# Altium schematic sheet core-unit.SchDoc
size 420 x 297 mm; SheetNumber: 1; SheetTotal: 2
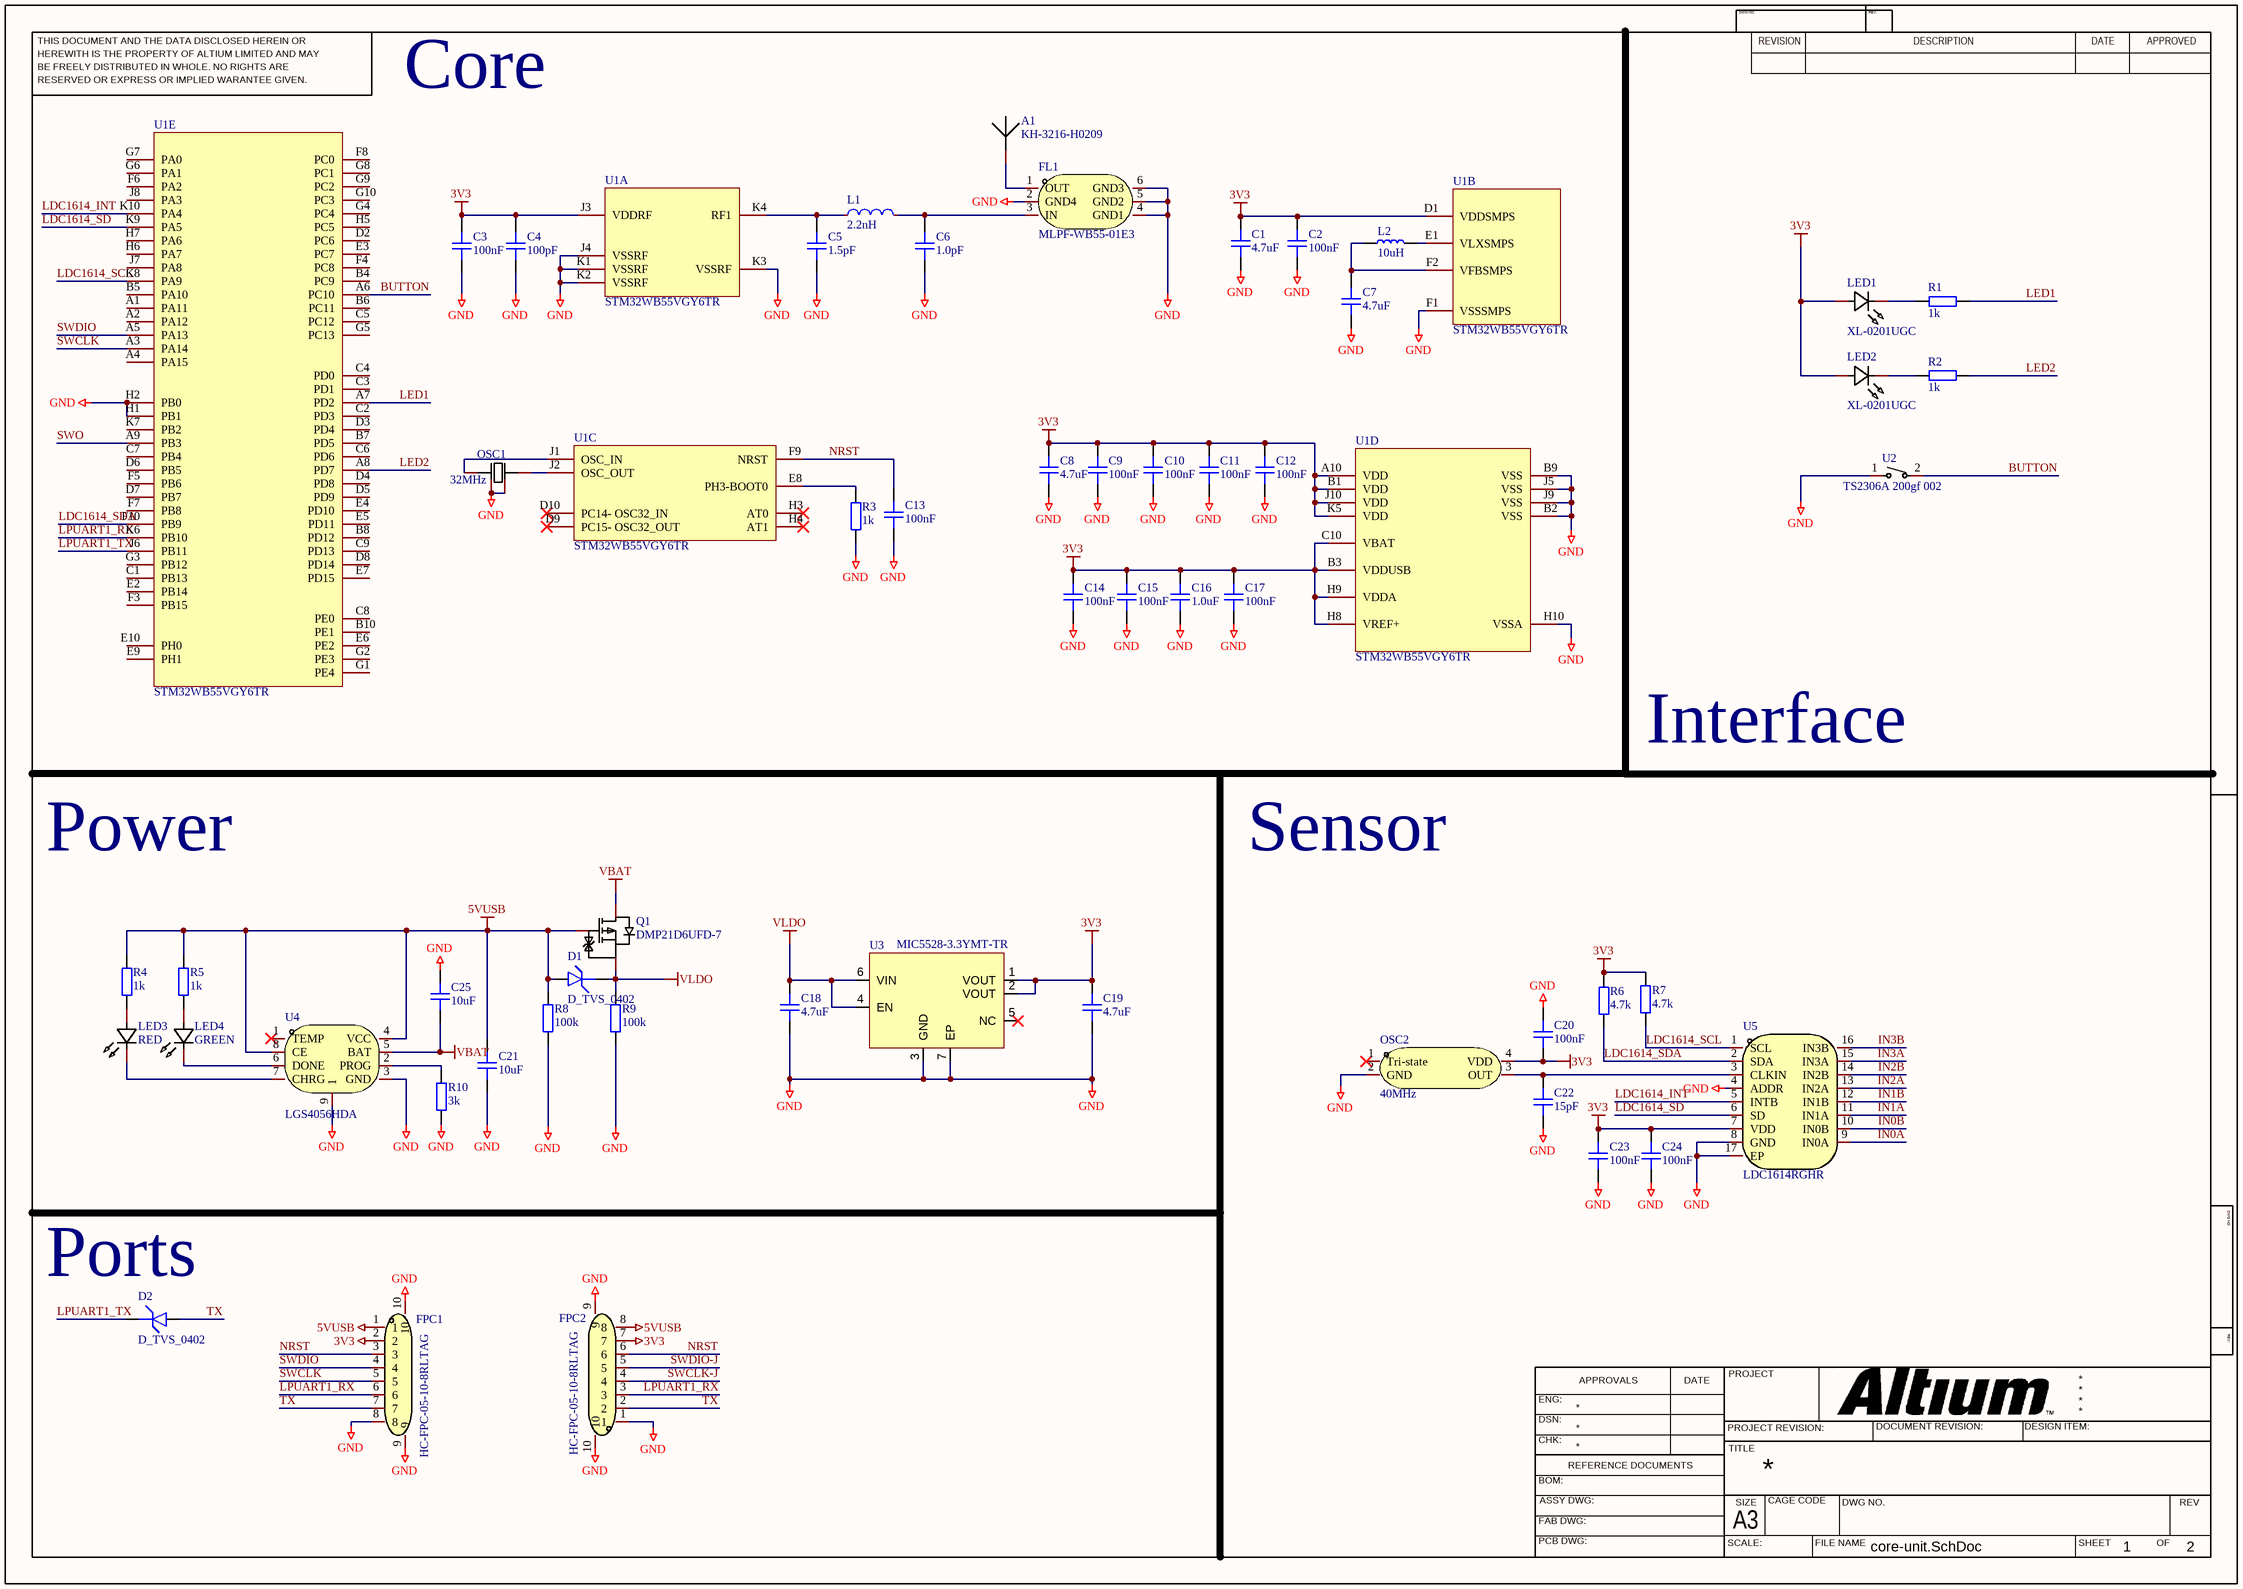
[diagram p0: core-unit.SchDoc]

## Parts
A1  KH-3216-H0209  [ANT-SMD_L1.7-W0.9]
C1  4.7uF  [CAP_0201]
C2  100nF  [CAP_0201]
C3  100nF  [CAP_0201]
C4  100pF  [CAP_0201]
C5  1.5pF  [CAP_0201]
C6  1.0pF  [CAP_0201]
C7  4.7uF  [CAP_0201]
C8  4.7uF  [CAP_0201]
C9  100nF  [CAP_0201]
C10  100nF  [CAP_0201]
C11  100nF  [CAP_0201]
C12  100nF  [CAP_0201]
C13  100nF  [CAP_0201]
C14  100nF  [CAP_0201]
C15  100nF  [CAP_0201]
C16  1.0uF  [CAP_0201]
C17  100nF  [CAP_0201]
C18  4.7uF  [CAP_0201]
C19  4.7uF  [CAP_0201]
C20  100nF  [CAP_0201]
C21  10uF  [CAP_0603]
C22  15pF  [CAP_0201]
C23  100nF  [CAP_0201]
C24  100nF  [CAP_0201]
C25  10uF  [CAP_0603]
D1  D_TVS_0402  [D_0402]
D2  D_TVS_0402  [D_0402]
FL1  MLPF-WB55-01E3  [FILTER-SMD_6P-L1.6-W1.0-P0.50-BL]
FPC1  HC-FPC-05-10-8RLTAG  [FPC-SMD_8P-P0.50_HCTL_HC-FPC-05-10-8RLTAG]
FPC2  HC-FPC-05-10-8RLTAG  [FPC-SMD_8P-P0.50_HCTL_HC-FPC-05-10-8RLTAG]
L1  2.2nH  [L0201]
L2  10uH  [IND_0603]
LED1  XL-0201UGC  [LED-SMD_L0.7-W0.4-RD_GREEN]
LED2  XL-0201UGC  [LED-SMD_L0.7-W0.4-RD_GREEN]
LED3  Name: RED  [LED-SMD_L0.7-W0.4-RD_GREEN]  (hidden comment: XL-0201UGC)
LED4  Name: GREEN  [LED-SMD_L0.7-W0.4-RD_GREEN]  (hidden comment: XL-0201UGC)
OSC1  32MHz  [CRYSTAL-SMD_4P-L1.6-W1.2-BL-1]
OSC2  40MHz  [OSC-SMD_4P-L2.0-W1.6-BL]
Q1  DMP21D6UFD-7  [X1-DFN1212-3_L1.2-W1.2-P0.80-BR]
R1  1k  [RES_0201]
R2  1k  [RES_0201]
R3  1k  [RES_0201]
R4  1k  [RES_0201]
R5  1k  [RES_0201]
R6  4.7k  [RES_0201]
R7  4.7k  [RES_0201]
R8  100k  [RES_0201]
R9  100k  [RES_0201]
R10  3k  [RES_0201]
U1  STM32WB55VGY6TR  [WLCSP-100_L4.4-W4.4-R10-C10-P0.40-TL_STM32WB55VGY6TR]  (parts A,B,C,D,E of 5)
U2  TS2306A 200gf 002  [SW-SMD_L3.0-W2.0-LS3.5]
U3  MIC5528-3.3YMT-TR  [TDFN-6]
U4  LGS4056HDA  [DFN-8_L2.0-W2.0-P0.50-TL-EP1.6]
U5  LDC1614RGHR  [WQFN-16_L4.0-W4.0-P0.50-TL-EP2.6-1]

## Nets
3V3: C1.2 C2.2 C3.2 C4.2 C8.2 C9.2 C10.2 C11.2 C12.2 C14.2 C15.2 C16.2 C17.2 C19.2 C20.1 C23.2 C24.2 FPC1.2 FPC2.7 LED1.2(A) LED2.2(A) OSC2.4(VDD) R6.2 R7.2 U1.A10(VDD) U1.B1(VDD) U1.B3(VDDUSB) U1.C10(VBAT) U1.D1(VDDSMPS) U1.H8(VREF+) U1.H9(VDDA) U1.J3(VDDRF) U1.J10(VDD) U1.K5(VDD) U3.1(VOUT) U3.2(VOUT) U5.7(VDD)
5VUSB: C21.2 D1.A FPC1.1 FPC2.8 Q1.1(G) R4.2 R5.2 R8.2 U4.4(VCC) U4.8(CE)
GND: C1.1 C2.1 C3.1 C4.1 C5.1 C6.1 C7.1 C8.1 C9.1 C10.1 C11.1 C12.1 C13.1 C14.1 C15.1 C16.1 C17.1 C18.1 C19.1 C20.2 C21.1 C22.1 C23.1 C24.1 C25.1 FL1.2(GND4) FL1.4(GND1) FL1.5(GND2) FL1.6(GND3) FPC1.8 FPC1.9 FPC1.10 FPC2.1 FPC2.9 FPC2.10 OSC1.2(GND) OSC1.4(GND) OSC2.2(GND) R3.1 R8.1 R9.1 R10.1 U1.B2(VSS) U1.B9(VSS) U1.F1(VSSSMPS) U1.H1(PB1) U1.H2(PB0) U1.H10(VSSA) U1.J4(VSSRF) U1.J5(VSS) U1.J9(VSS) U1.K1(VSSRF) U1.K2(VSSRF) U1.K3(VSSRF) U2.1(A) U3.3(GND) U3.7(EP) U4.3(GND) U4.9(1) U5.4(ADDR) U5.8(GND) U5.17(EP)
VBAT: C25.2 Q1.3(D) U4.5(BAT)
VLDO: C18.2 D1.K Q1.2(S) R9.2 U3.4(EN) U3.6(VIN)
BUTTON: U1.A6(PC10) U2.2(A&apos;)
IN0A: U5.9(IN0A)
IN0B: U5.10(IN0B)
IN1A: U5.11(IN1A)
IN1B: U5.12(IN1B)
IN2A: U5.13(IN2A)
IN2B: U5.14(IN2B)
IN3A: U5.15(IN3A)
IN3B: U5.16(IN3B)
LDC1614_INT: U1.K10(PA4) U5.5(INTB)
LDC1614_SCL: R7.1 U1.K8(PA9) U5.1(SCL)
LDC1614_SD: U1.K9(PA5) U5.6(SD)
LDC1614_SDA: R6.1 U1.F10(PB9) U5.2(SDA)
LED1: R1.1 U1.A7(PD2)
LED2: R2.1 U1.A8(PD7)
LPUART1_RX: FPC1.6 FPC2.3 U1.K6(PB10)
LPUART1_TX: D2.K U1.J6(PB11)
NRST: C13.2 FPC1.3 FPC2.6 U1.F9(NRST)
SWCLK: FPC1.5 U1.A3(PA14)
SWCLK-J: FPC2.4
SWDIO: FPC1.4 U1.A5(PA13)
SWDIO-J: FPC2.5
SWO: U1.A9(PB3)
TX: D2.A FPC1.7 FPC2.2
NetA1_1: A1.1(ANT) FL1.1(OUT)
NetC5_2: C5.2 L1.1 U1.K4(RF1)
NetC6_2: C6.2 FL1.3(IN) L1.2
NetC7_2: C7.2 L2.1 U1.F2(VFBSMPS)
NetC22_2: C22.2 OSC2.3(OUT) U5.3(CLKIN)
NetL2_2: L2.2 U1.E1(VLXSMPS)
NetLED1_1: LED1.1(K) R1.2
NetLED2_1: LED2.1(K) R2.2
NetLED3_1: LED3.1(K) U4.7(CHRG)
NetLED3_2: LED3.2(A) R4.1
NetLED4_1: LED4.1(K) U4.6(DONE)
NetLED4_2: LED4.2(A) R5.1
NetOSC1_1: OSC1.1(OSC1) U1.J2(OSC_OUT)
NetOSC1_3: OSC1.3(OSC2) U1.J1(OSC_IN)
NetR3_2: R3.2 U1.E8(PH3-BOOT0)
NetR10_2: R10.2 U4.2(PROG)

Not connected (* = marked no-connect by the designer): A1 2; OSC2 1(Tri-state)*; U1 A1(PA11) A2(PA12) A4(PA15) B4(PC9) B5(PA10) B6(PC11) B7(PD5) B8(PD12) B10(PE1) C1(PB13) C2(PD3) C3(PD1) C4(PD0) C5(PC12) C6(PD6) C7(PB4) C8(PE0) C9(PD13) D2(PC6) D3(PD4) D4(PD8) D5(PD9) D6(PB5) D7(PB7) D8(PD14) D9(PC15-_OSC32_OUT)* D10(PC14-_OSC32_IN)* E2(PB14) E3(PC7) E4(PD10) E5(PD11) E6(PE2) E7(PD15) E9(PH1) E10(PH0) F3(PB15) F4(PC8) F5(PB6) F6(PA2) F7(PB8) F8(PC0) G1(PE4) G2(PE3) G3(PB12) G4(PC4) G5(PC13) G6(PA1) G7(PA0) G8(PC1) G9(PC2) G10(PC3) H3(AT0)* H4(AT1)* H5(PC5) H6(PA7) H7(PA6) J7(PA8) J8(PA3) K7(PB2); U3 5(NC)*; U4 1(TEMP)*

## Notes on the sheet
- Core
- Interface
- Power
- Sensor
- (near D2) Ports
- THIS DOCUMENT AND THE DATA DISCLOSED HEREIN OR
- HEREWITH IS THE PROPERTY OF ALTIUM LIMITED AND MAY
- DWG NO:
- REVISION
- REV:
- DESCRIPTION
- DATE
- APPROVED
- BE FREELY DISTRIBUTED IN WHOLE. NO RIGHTS ARE
- RESERVED OR EXPRESS OR IMPLIED WARANTEE GIVEN.
- ENG:
- APPROVALS
- PROJECT
- DSN:
- CHK:
- REFERENCE DOCUMENTS
- PROJECT REVISION:
- TITLE
- DOCUMENT REVISION:
- DESIGN ITEM:
- BOM:
- FAB DWG:
- PCB DWG:
- ASSY DWG:
- SCALE:
- A3
- SIZE
- CAGE CODE
- FILE NAME
- DWG NO.
- SHEET
- OF
- REV

## Library data of the parts
A1 = ANTENNA: 陶瓷贴片天线; Manufacturer: kinghelm(金航标); Add into BOM: yes; Symbol: KH-3216-H0209; Device: KH-3216-H0209; LCSC Part Name: KH-3216-H0209; Supplier Part: C2925417; Manufacturer Part: KH-3216-H0209; Supplier Footprint: 1206; JLCPCB Part Class: 扩展库; Datasheet: https://atta.szlcsc.com/upload/public/pdf/source/20211126/47D9D63D1A7578CBC67CF3AB2A53F46A.pdf; Supplier: LCSC; Convert to PCB: yes; Name: KH-3216-H0209
C1-C20 C22-C24 = CAP_0201: Capacitor SMD 0201; Manufacturer: *; Manufacturer Part Number: *; Distributor Link: *; LCSC: *; Rating: *; Dielectric: *
C21 C25 = CAP_0603: Capacitor SMD 0603; Manufacturer: *; Manufacturer Part Number: *; Distributor Link: *; LCSC: *; Rating: *; Dielectric: *
D1 D2 = D_TVS_0402: Diode TVS / ESD 0402
FL1 = MLPF-WB55-01E3: 滤波器 2.4G; Manufacturer: ST(意法半导体); Add into BOM: yes; Bandwidth: 100MHz; Filter Type: 低通; Insertion Loss: 1.1dB; Symbol: MLPF-WB55-01E3; Device: MLPF-WB55-01E3; LCSC Part Name: 2.45GHz 中心 低通; Supplier Part: C2651048; Manufacturer Part: MLPF-WB55-01E3; Supplier Footprint: SMD-6P,1.6x1mm; JLCPCB Part Class: 扩展库; Datasheet: https://atta.szlcsc.com/upload/public/pdf/source/20210702/9A61CA581AD9994A0E14452110FC9469.pdf; Supplier: LCSC; Convert to PCB: yes; Name: MLPF-WB55-01E3
FPC1 FPC2 = HC-FPC-05-10-8RLTAG: FPC连接器 0.5mm pitch 8p; Manufacturer: HCTL(华灿天禄); Add into BOM: yes; Locking Feature: 翻盖式; FFC, FCB Thickness: 0.3mm; Symbol: HC-FPC-05-10-8RLTAG; Device: HC-FPC-05-10-8RLTAG; LCSC Part Name: 翻盖式 下接 P数:8P 间距:0.5mm; Supplier Part: C5213730; Manufacturer Part: HC-FPC-05-10-8RLTAG; Supplier Footprint: SMD,P=0.5mm,卧贴; JLCPCB Part Class: 扩展库; Datasheet: https://atta.szlcsc.com/upload/public/pdf/source/20221027/B2DE489DA152049D1F105170189CFB4E.pdf; Supplier: LCSC; Convert to PCB: yes; Contact Type: 下接; Number of Contacts: 8P; Pitch: 0.5mm; Mounting Type: 卧贴; Height Above Board: 1mm; Contact Material: 铜合金; Operating Temperature Range: -55℃~+85℃; Name: HC-FPC-05-10-8RLTAG
L1 = L0201: Manufacturer: muRata(村田); Symbol: LQP03TN2N2B02D; Add into BOM: yes; Rated Current: 600mA; DC Resistance (DCR): 150mΩ; Q @ Freq: 14@500MHz; Frequency - Self Resonant: 11GHz; Device: LQP03TN2N2B02D; LCSC Part Name: 2.2nH; Supplier Part: C98041; Manufacturer Part: LQP03TN2N2B02D; Supplier Footprint: 0201; JLCPCB Part Class: 扩展库; Datasheet: https://atta.szlcsc.com/upload/public/pdf/source/20200107/C157592_7FF58F85BAEF0D918ADFA12AEC0AEBA8.pdf; Supplier: LCSC; Convert to PCB: yes; Value: 2.2nH; Tolerance: -; Saturation Current (Isat): -; Ratings: -; Name: 2.2nH
L2 = IND_0603: Inductor SMD 0603
LED1-LED4 = LED_0201: Manufacturer: XINGLIGHT(成兴光); Add into BOM: yes; Emitted Color: 翠绿色; Forward Voltage (VF): 2.6V~3.2V; Power Dissipation: 80mW; Forward Current: 5mA; Dominant Wavelength: 525nm; Lens Color: 透明透镜; Luminous Intensity: 150mcd~350mcd; Viewing Angle: 120°; Mounting Sytle: 正贴; Symbol: XL-0201UGC; Device: XL-0201UGC; LCSC Part Name: XL-0201UGC; Supplier Part: C3646922; Manufacturer Part: XL-0201UGC; Supplier Footprint: 0201; JLCPCB Part Class: 扩展库; Datasheet: https://atta.szlcsc.com/upload/public/pdf/source/20220704/E0793CD8344CCC1EE8399F6C022919A7.pdf; Supplier: LCSC; Convert to PCB: yes; Operating Temperature: -30℃~+85℃
  LED1 LED2: Name: XL-0201UGC
OSC1 = X161232MMB4SI: 晶振 1612; Manufacturer: YXC(扬兴晶振); Add into BOM: yes; Crystal Type: 贴片晶振; Normal temperature Frequency Tolerance: ±10ppm; Load Capacitor: 10pF; Frequency Stability(Full temperature range): ±30ppm; Symbol: X161232MMB4SI; Device: X161232MMB4SI; LCSC Part Name: 32MHz ±10ppm 10pF; Supplier Part: C2982343; Manufacturer Part: X161232MMB4SI; Supplier Footprint: SMD1612-4P; JLCPCB Part Class: 扩展库; Datasheet: https://atta.szlcsc.com/upload/public/pdf/source/20240329/D9025446BDBD7B39CDD0BF685E81FE1D.pdf; Supplier: LCSC; Convert to PCB: yes; Value: 32MHz; Equivalent Series Resistance (ESR): -; Operating Temperature: -40℃~+85℃; mounting type: -; Name: 32MHz
OSC2 = OT7EL89CJI-111YLC-40M: 有源晶振 40MHz; Manufacturer: YXC(扬兴晶振); Add into BOM: yes; Normal temperature Frequency Tolerance: ±10ppm; Output Type: CMOS; Supply Voltage: 1.8V~3.3V; Frequency Stability(Full temperature range): ±20ppm; Symbol: OT7EL89CJI-111YLC-40M; Device: OT7EL89CJI-111YLC-40M; LCSC Part Name: 40MHZ 1.8V-3.3V ±10PPM YSO110TR; Supplier Part: C7434947; Manufacturer Part: OT7EL89CJI-111YLC-40M; Supplier Footprint: SMD2016-4P; JLCPCB Part Class: 扩展库; Datasheet: https://atta.szlcsc.com/upload/public/pdf/source/20240731/596E5F7673E50DA744B7F79F139FB8DF.pdf; Supplier: LCSC; Convert to PCB: yes; Value: 40MHz; Operating Temperature: -40℃~+85℃; Name: 40MHz
Q1 = PMOS_DFN-3_1.2x1.2: Manufacturer: DIODES(美台); Add into BOM: yes; Type: 1个P沟道; Drain Source Voltage (Vdss): 20V; Continuous Drain Current (Id): 600mA; Drain Source On Resistance (RDS(on)@Vgs,Id): 1Ω@4.5V,600mA; Power Dissipation (Pd): 800mW; Gate Threshold Voltage (Vgs(th)@Id): 1V@250uA; Total Gate Charge (Qg@Vgs): 800pC; Input Capacitance (Ciss@Vds): 46.1pF@10V; Reverse Transfer Capacitance (Crss@Vds): 4.9pF@10V; Symbol: DMP21D6UFD-7; Device: DMP21D6UFD-7; LCSC Part Name: 1个P沟道 耐压:20V 电流:600mA; Supplier Part: C2960365; Manufacturer Part: DMP21D6UFD-7; Supplier Footprint: X1-DFN1212-3; JLCPCB Part Class: 扩展库; Datasheet: https://atta.szlcsc.com/upload/public/pdf/source/20220120/CC101C4482074BD50B9EB78563090653.pdf; Supplier: LCSC; Convert to PCB: yes; Operating Temperature: -55℃~+150℃; Name: DMP21D6UFD-7
R1-R10 = RES_0201: Resistor SMD 0201; Manufacturer: *; Manufacturer Part Number: *; Distributor Link: *; LCSC: *
U1 = STM32WB55VGY6TR: WLCSP-100; Manufacturer: ST(意法半导体); Add into BOM: yes; Frequency Range: 2.405GHz~2.48GHz; Interface: ADC,I2C,SPI,UART,USART,USB; Operating Voltage: 1.71V~3.6V; Output Power: 6dBm; Data Rate: 2Mbps; Current Of Transmitting: 5.2mA; Sensitivity: -100dBm; Receive Current: 4.5mA; Symbol: STM32WB55VGY6TR; Device: STM32WB55VGY6TR; LCSC Part Name: 超低功耗双核64 MHz Arm Cortex-M4 + 32MHz Cortex-M0+ MCU，具有1 MB Flash存储器、蓝牙5, 802.15.4、USB、LCD和AES-256; Supplier Part: C1850399; Manufacturer Part: STM32WB55VGY6TR; Supplier Footprint: WLCSP-100(4.4x4.4); JLCPCB Part Class: 扩展库; Datasheet: https://atta.szlcsc.com/upload/public/pdf/source/20210601/5432F19F1D5A2A3CB39F31675BD897C7.pdf; Supplier: LCSC; Convert to PCB: yes; Applications: 802.15.4；蓝牙; Operating Temperature: -40℃~+85℃; Name: STM32WB55VGY6TR
U2 = TS2306A 200gf 002: 轻触按键开关复位; Manufacturer: SHOU HAN(首韩); Add into BOM: yes; Circuit: 单刀单掷; Actuator Style: 圆形按钮; Switch Length: 3mm; Switch Width: 2mm; Switch Height: 0.6mm; Strike Gundam: 不带; Contact Current: 50mA; Voltage Rating (DC): 5V; Power Rating: 0.25W; Insulation Resistance: 100MΩ; Actuator/Cap Color: 黄色; With Lamp: 无; Mechanical Life: 30万次; Symbol: TS2306A 200GF 002; Device: TS2306A 200gf 002; LCSC Part Name: 薄膜开关 2*3*0.6mm 蓝牙耳机/开机按键 两脚 黄膜黑点 200gf; Supplier Part: C5363482; Manufacturer Part: TS2306A 200gf 002; Supplier Footprint: SMD; JLCPCB Part Class: 扩展库; Datasheet: https://atta.szlcsc.com/upload/public/pdf/source/20230321/144662D432400ADC228EB2A996730BBD.pdf; Supplier: LCSC; Convert to PCB: yes; Operating Force: 200gf; Mounting Style: 立贴; Operating Temperature: -40℃~+80℃; Name: TS2306A 200gf 002
U3 = MIC5528-3.3YMT-TR: LDO Regulator 3V3 500mA 2.5V<Vin<5.5V; Manufacturer: Microchip; Manufacturer Part Number: MIC5528-3.3YMT-TR
U4 = LGS4056HDA: 1s锂电池充电芯片; Manufacturer: Legend-Si(棱晶半导体); Add into BOM: yes; The Chip Type: 线性充电芯片; Supply Voltage: 4V~6V; Maximum Charge Current: 1A; Charging Saturation Voltage: 4.2V; Type of Battery: 锂离子/聚合物; Number of Cells: 1; Symbol: LGS4056H; Device: LGS4056HDA; LCSC Part Name: TP4056H(DFN); Supplier Part: C5124109; Manufacturer Part: LGS4056HDA; Supplier Footprint: DFN-8(2x2); JLCPCB Part Class: 扩展库; Datasheet: https://atta.szlcsc.com/upload/public/pdf/source/20230407/EF281A5928E4D64337F5505487E44644.pdf; Supplier: LCSC; Convert to PCB: yes; Operating Temperature: -40℃~+125℃; Name: LGS4056HDA
U5 = LDC1614RGHR: 电感测量芯片; Manufacturer: TI(德州仪器); Add into BOM: yes; Symbol: LDC1614RGHR; Device: LDC1614RGHR; LCSC Part Name: 适用于电感感应的LDC1612、LDC1614多通道28位电感数字转换器; Supplier Part: C968448; Manufacturer Part: LDC1614RGHR; Supplier Footprint: WQFN-16-EP(4x4); JLCPCB Part Class: 扩展库; Datasheet: https://www.ti.com/cn/lit/gpn/ldc1614; Supplier: LCSC; Convert to PCB: yes; Name: LDC1614RGHR